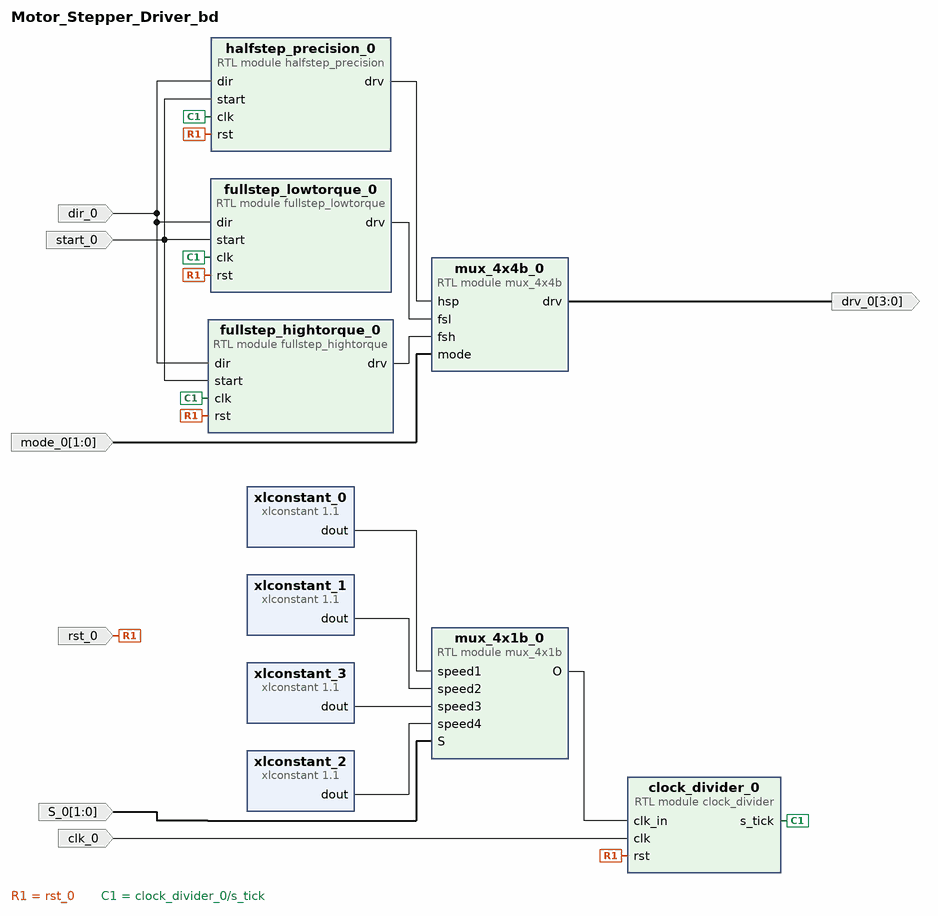
[diagram p0: block diagram of the top level]
# Vivado block design Motor_Stepper_Driver_bd, xc7a100tcsg324-1, Vivado 2018.2.1
create_bd_design Motor_Stepper_Driver_bd

create_bd_port -dir I -from 1 -to 0 S_0
create_bd_port -dir I -type rst rst_0
create_bd_port -dir I -type clk clk_0
create_bd_port -dir I dir_0
create_bd_port -dir I start_0
create_bd_port -dir I -from 1 -to 0 mode_0
create_bd_port -dir O -from 3 -to 0 drv_0

create_bd_cell -type module -reference halfstep_precision halfstep_precision_0
create_bd_cell -type module -reference fullstep_lowtorque fullstep_lowtorque_0
create_bd_cell -type module -reference fullstep_hightorque fullstep_hightorque_0
create_bd_cell -type module -reference mux_4x1b mux_4x1b_0
create_bd_cell -type module -reference mux_4x4b mux_4x4b_0
create_bd_cell -type module -reference clock_divider clock_divider_0
create_bd_cell -type ip -vlnv xilinx.com:ip:xlconstant:1.1 xlconstant_0
set_property -dict {CONFIG.CONST_WIDTH 12 CONFIG.CONST_VAL 10} [get_bd_cells xlconstant_0]
create_bd_cell -type ip -vlnv xilinx.com:ip:xlconstant:1.1 xlconstant_1
set_property -dict {CONFIG.CONST_WIDTH 12 CONFIG.CONST_VAL 100} [get_bd_cells xlconstant_1]
create_bd_cell -type ip -vlnv xilinx.com:ip:xlconstant:1.1 xlconstant_2
set_property -dict {CONFIG.CONST_WIDTH 11 CONFIG.CONST_VAL 500} [get_bd_cells xlconstant_2]
create_bd_cell -type ip -vlnv xilinx.com:ip:xlconstant:1.1 xlconstant_3
set_property -dict {CONFIG.CONST_WIDTH 12 CONFIG.CONST_VAL 250} [get_bd_cells xlconstant_3]

# ---- connections ----

connect_bd_net [get_bd_pins xlconstant_0/dout] [get_bd_pins mux_4x1b_0/speed1]
connect_bd_net [get_bd_pins xlconstant_1/dout] [get_bd_pins mux_4x1b_0/speed2]
connect_bd_net [get_bd_pins xlconstant_3/dout] [get_bd_pins mux_4x1b_0/speed3]
connect_bd_net [get_bd_pins xlconstant_2/dout] [get_bd_pins mux_4x1b_0/speed4]
connect_bd_net -net S_0_1 [get_bd_ports S_0] [get_bd_pins mux_4x1b_0/S]
connect_bd_net [get_bd_pins mux_4x1b_0/O] [get_bd_pins clock_divider_0/clk_in]
connect_bd_net -net rst_0_1 [get_bd_ports rst_0] \
  [get_bd_pins clock_divider_0/rst] [get_bd_pins fullstep_hightorque_0/rst] [get_bd_pins fullstep_lowtorque_0/rst] \
  [get_bd_pins halfstep_precision_0/rst]
connect_bd_net -net dir_0_1 [get_bd_ports dir_0] \
  [get_bd_pins fullstep_lowtorque_0/dir] [get_bd_pins fullstep_hightorque_0/dir] [get_bd_pins halfstep_precision_0/dir]
connect_bd_net -net start_0_1 [get_bd_ports start_0] \
  [get_bd_pins fullstep_lowtorque_0/start] [get_bd_pins halfstep_precision_0/start] [get_bd_pins fullstep_hightorque_0/start]
connect_bd_net [get_bd_pins clock_divider_0/s_tick] \
  [get_bd_pins fullstep_hightorque_0/clk] [get_bd_pins fullstep_lowtorque_0/clk] [get_bd_pins halfstep_precision_0/clk]
connect_bd_net -net clk_0_1 [get_bd_ports clk_0] [get_bd_pins clock_divider_0/clk]
connect_bd_net [get_bd_pins fullstep_lowtorque_0/drv] [get_bd_pins mux_4x4b_0/fsl]
connect_bd_net [get_bd_pins fullstep_hightorque_0/drv] [get_bd_pins mux_4x4b_0/fsh]
connect_bd_net [get_bd_pins halfstep_precision_0/drv] [get_bd_pins mux_4x4b_0/hsp]
connect_bd_net -net mode_0_1 [get_bd_ports mode_0] [get_bd_pins mux_4x4b_0/mode]
connect_bd_net [get_bd_pins mux_4x4b_0/drv] [get_bd_ports drv_0]

validate_bd_design
save_bd_design
